# EAGLE schematic ionode (EAGLE 7.7.0)
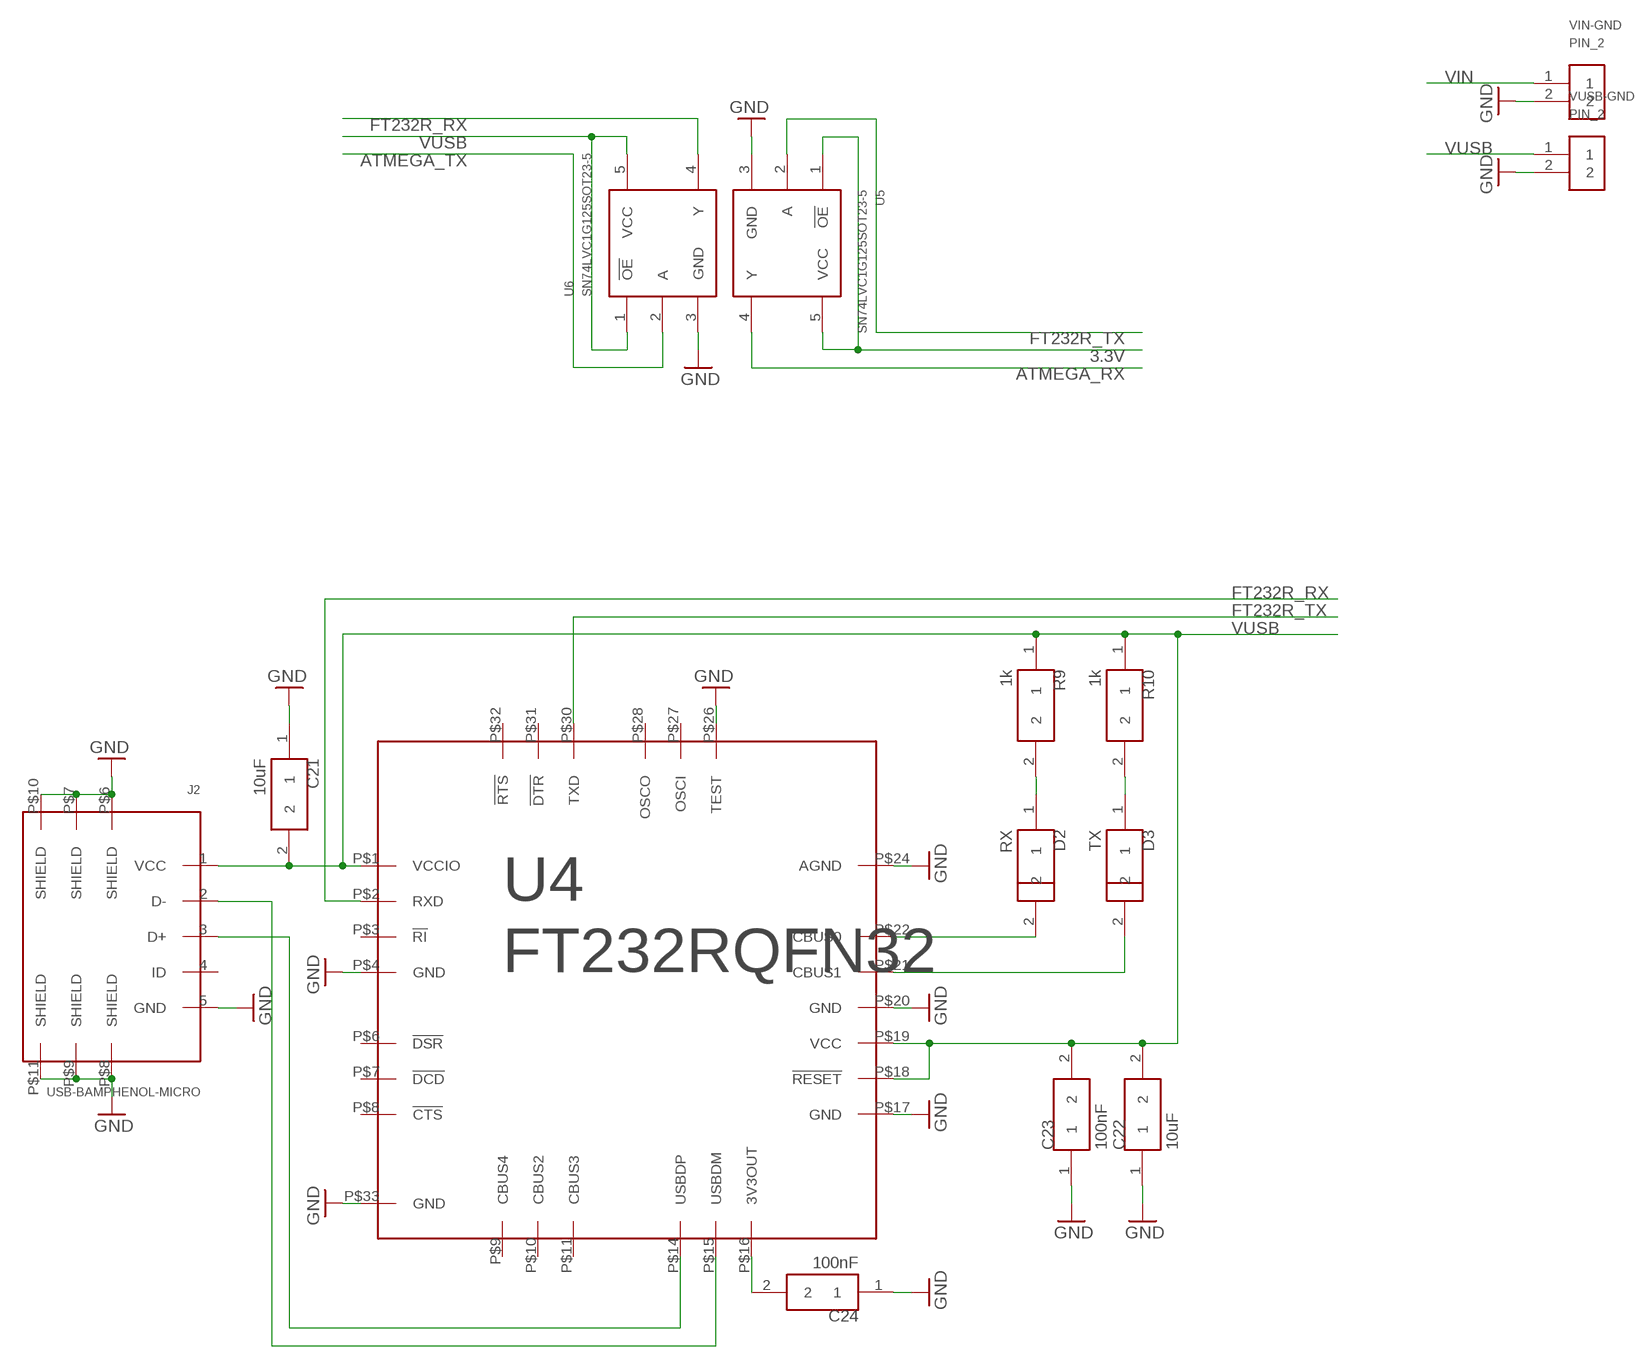
[diagram p0: schematic, sheet 1, part 1 of 2]
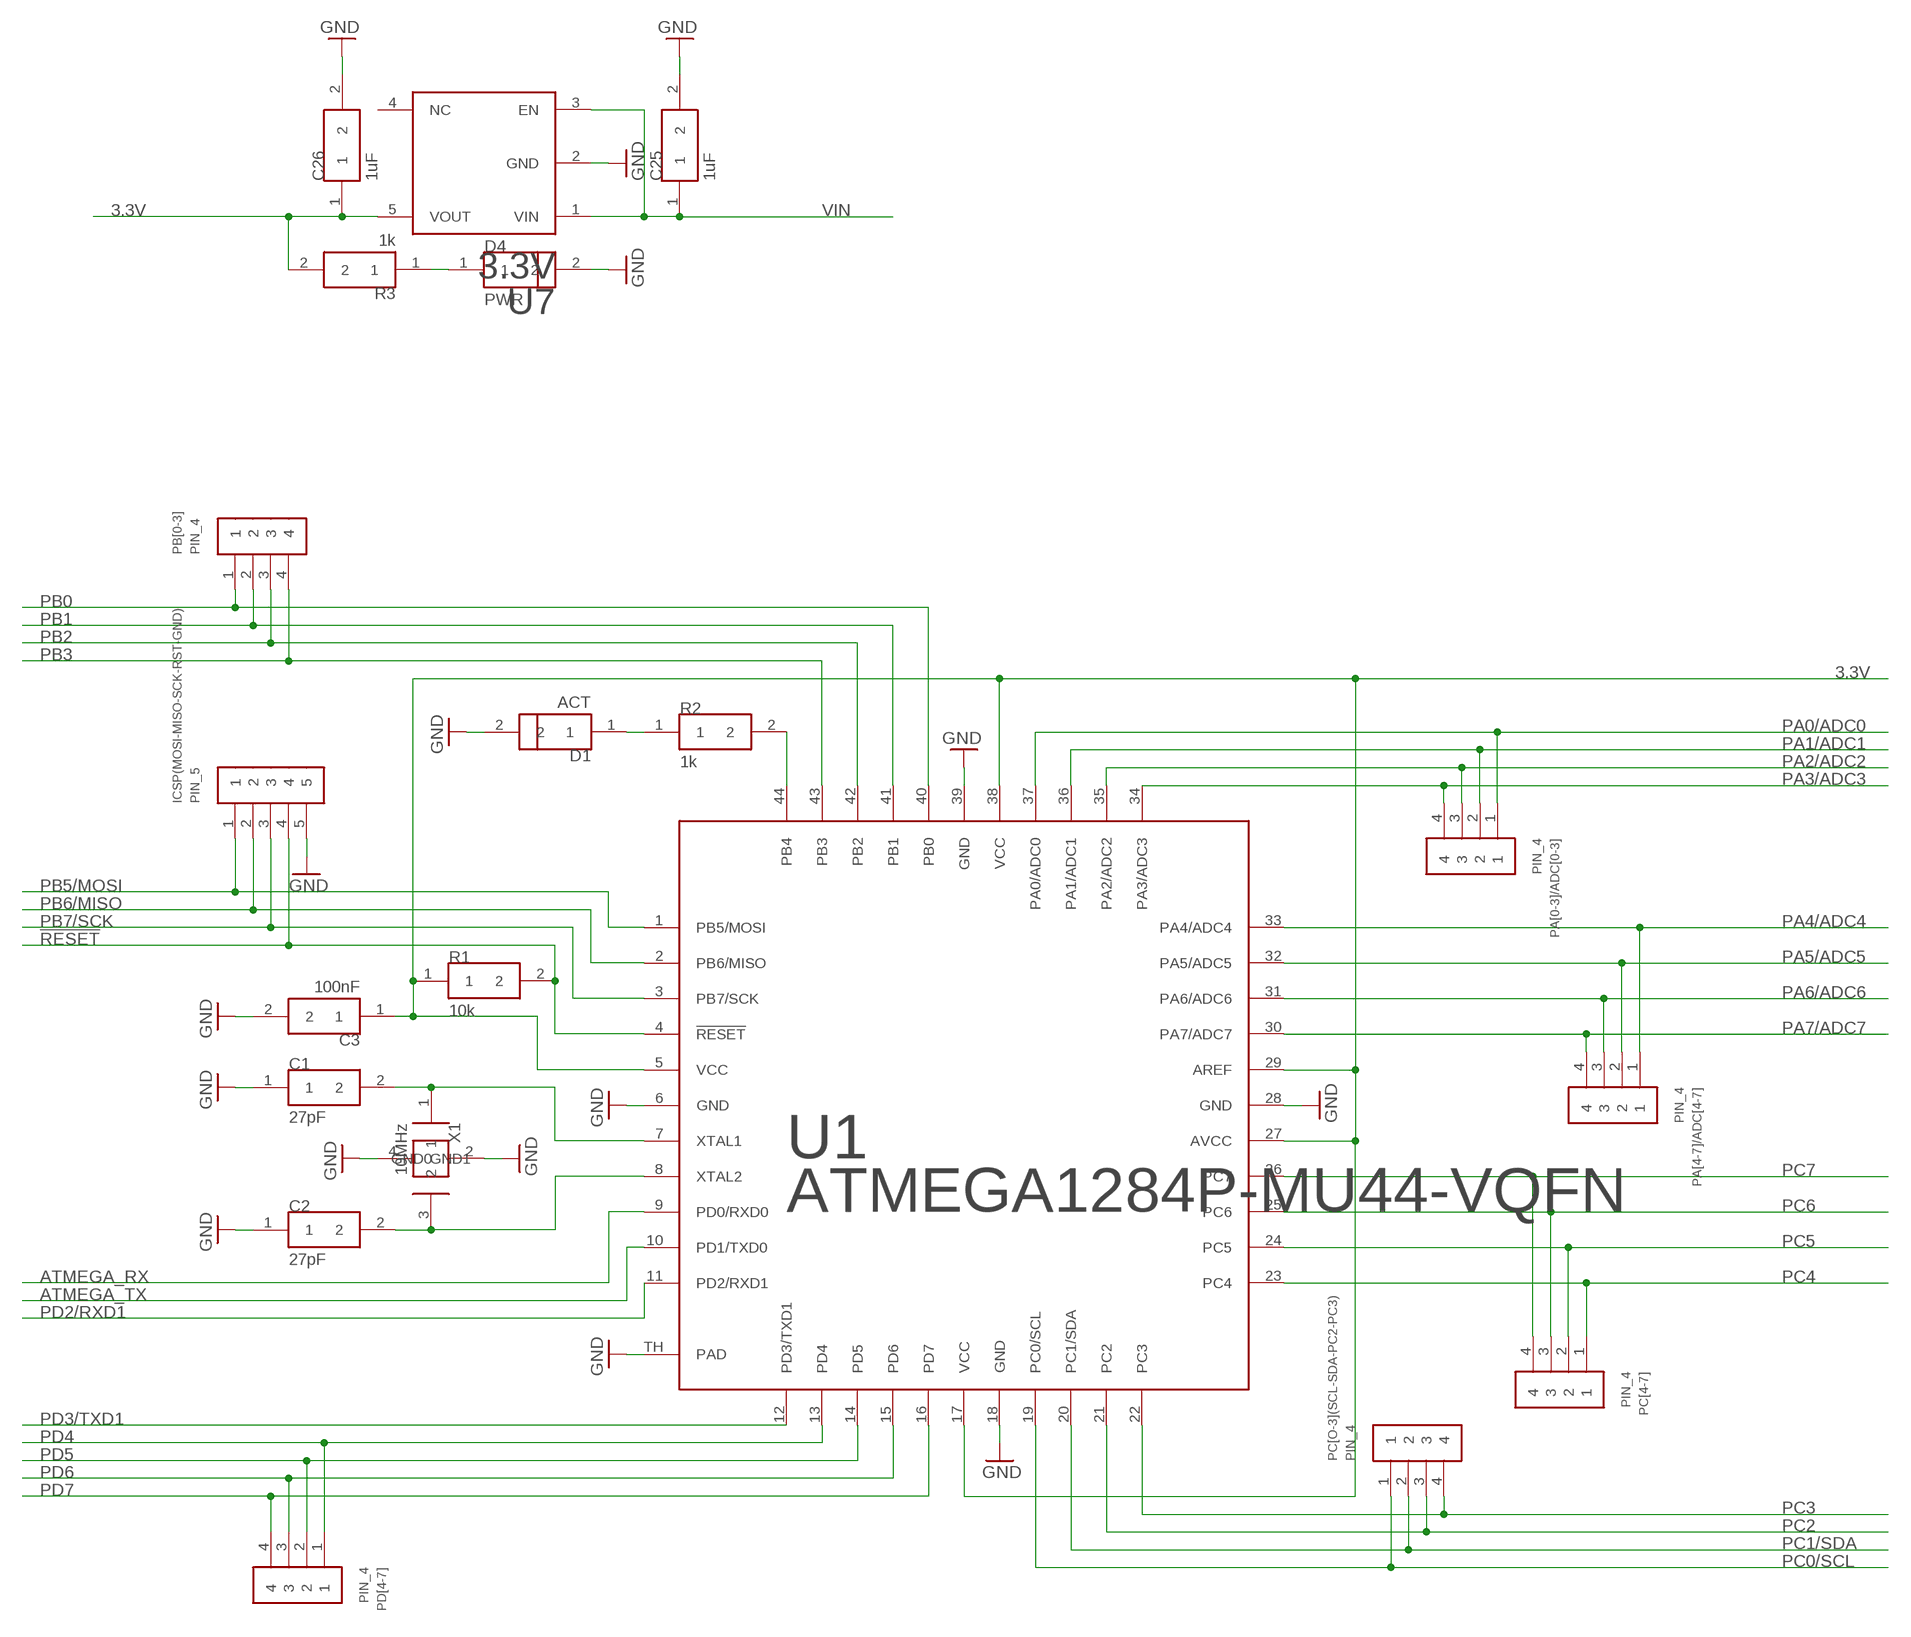
[diagram p1: schematic, sheet 1, part 2 of 2]

## Parts
C1  27pF  CAP0805  [0805]
C2  27pF  CAP0805  [0805]
C3  100nF  CAP0805  [0805]
C21  10uF  CAP0805  [0805]
C22  10uF  CAP0805  [0805]
C23  100nF  CAP0805  [0805]
C24  100nF  CAP0805  [0805]
C25  1uF  CAP0805  [0805]
C26  1uF  CAP0805  [0805]
D1  ACT  LED0805  [0805]
D2  RX  LED0805  [0805]
D3  TX  LED0805  [0805]
D4  PWR  LED0805  [0805]
ICSP(MOSI-MISO-SCK-RST-GND)  PIN_5  [PIN_5]
J2  USB-BAMPHENOL-MICRO  [AMPHENOL-USB-MICRO-B]
PA[0-3]/ADC[0-3]  PIN_4  [PIN_4]
PA[4-7]/ADC[4-7]  PIN_4  [PIN_4]
PB[0-3]  PIN_4  [PIN_4]
PC[4-7]  PIN_4  [PIN_4]
PC[O-3](SCL-SDA-PC2-PC3)  PIN_4  [PIN_4]
PD[4-7]  PIN_4  [PIN_4]
R1  10k  RES0805  [0805]
R2  1k  RES0805  [0805]
R3  1k  RES0805  [0805]
R9  1k  RES0805  [0805]
R10  1k  RES0805  [0805]
U1  ATMEGA1284P-MU44-VQFN  [44-VQFN]
U4  FT232RQFN32  [32-VQFN]
U5  SN74LVC1G125SOT23-5  [SOT23-5]
U6  SN74LVC1G125SOT23-5  [SOT23-5]
U7  3.3V  LP3985SOT23-5  [SOT23-5]
VIN-GND  PIN_2  [PIN_2]
VUSB-GND  PIN_2  [PIN_2]
X1  10MHz  XTAL_GNDSMD_3225  [XTAL_3225]

## Nets
3.3V: C3.1 C26.1 R1.1 R3.2 U1.5(VCC) U1.17(VCC) U1.27(AVCC) U1.29(AREF) U1.38(VCC) U5.1(!OE) U5.5(VCC) U7.5(VOUT)
!RESET: ICSP(MOSI-MISO-SCK-RST-GND).4 R1.2 U1.4(!RESET)
ATMEGA_RX: U1.9(PD0/RXD0) U5.4(Y)
ATMEGA_TX: U1.10(PD1/TXD0) U6.2(A)
FT232R_RX: U4.P$2(RXD) U6.4(Y)
FT232R_TX: U4.P$30(TXD) U5.2(A)
GND: C1.1 C2.1 C3.2 C21.1 C22.1 C23.1 C24.1 C25.2 C26.2 D1.2 D4.2 ICSP(MOSI-MISO-SCK-RST-GND).5 J2.5(GND) J2.P$6(SHIELD) J2.P$7(SHIELD) J2.P$8(SHIELD) J2.P$9(SHIELD) J2.P$10(SHIELD) J2.P$11(SHIELD) U1.6(GND) U1.18(GND) U1.28(GND) U1.39(GND) U1.TH(PAD) U4.P$4(GND) U4.P$17(GND) U4.P$20(GND) U4.P$24(AGND) U4.P$26(TEST) U4.P$33(GND) U5.3(GND) U6.3(GND) U7.2(GND) VIN-GND.2 VUSB-GND.2 X1.2(GND0) X1.4(GND1)
N$1: C2.2 U1.8(XTAL2) X1.3
N$2: C1.2 U1.7(XTAL1) X1.1
N$3: D4.1 R3.1
N$5: D1.1 R2.1
N$6: R2.2 U1.44(PB4)
N$21: C24.2 U4.P$16(3V3OUT)
N$22: D2.2 U4.P$22(CBUS0)
N$23: D3.2 U4.P$21(CBUS1)
N$24: D2.1 R9.2
N$25: D3.1 R10.2
N$26: J2.2(D-) U4.P$15(USBDM)
N$27: J2.3(D+) U4.P$14(USBDP)
PA0/ADC0: PA[0-3]/ADC[0-3].1 U1.37(PA0/ADC0)
PA1/ADC1: PA[0-3]/ADC[0-3].2 U1.36(PA1/ADC1)
PA2/ADC2: PA[0-3]/ADC[0-3].3 U1.35(PA2/ADC2)
PA3/ADC3: PA[0-3]/ADC[0-3].4 U1.34(PA3/ADC3)
PA4/ADC4: PA[4-7]/ADC[4-7].1 U1.33(PA4/ADC4)
PA5/ADC5: PA[4-7]/ADC[4-7].2 U1.32(PA5/ADC5)
PA6/ADC6: PA[4-7]/ADC[4-7].3 U1.31(PA6/ADC6)
PA7/ADC7: PA[4-7]/ADC[4-7].4 U1.30(PA7/ADC7)
PB0: PB[0-3].1 U1.40(PB0)
PB1: PB[0-3].2 U1.41(PB1)
PB2: PB[0-3].3 U1.42(PB2)
PB3: PB[0-3].4 U1.43(PB3)
PB5/MOSI: ICSP(MOSI-MISO-SCK-RST-GND).1 U1.1(PB5/MOSI)
PB6/MISO: ICSP(MOSI-MISO-SCK-RST-GND).2 U1.2(PB6/MISO)
PB7/SCK: ICSP(MOSI-MISO-SCK-RST-GND).3 U1.3(PB7/SCK)
PC0/SCL: PC[O-3](SCL-SDA-PC2-PC3).1 U1.19(PC0/SCL)
PC1/SDA: PC[O-3](SCL-SDA-PC2-PC3).2 U1.20(PC1/SDA)
PC2: PC[O-3](SCL-SDA-PC2-PC3).3 U1.21(PC2)
PC3: PC[O-3](SCL-SDA-PC2-PC3).4 U1.22(PC3)
PC4: PC[4-7].1 U1.23(PC4)
PC5: PC[4-7].2 U1.24(PC5)
PC6: PC[4-7].3 U1.25(PC6)
PC7: PC[4-7].4 U1.26(PC7)
PD2/RXD1: U1.11(PD2/RXD1)
PD3/TXD1: U1.12(PD3/TXD1)
PD4: PD[4-7].1 U1.13(PD4)
PD5: PD[4-7].2 U1.14(PD5)
PD6: PD[4-7].3 U1.15(PD6)
PD7: PD[4-7].4 U1.16(PD7)
VIN: C25.1 U7.1(VIN) U7.3(EN) VIN-GND.1
VUSB: C21.2 C22.2 C23.2 J2.1(VCC) R9.1 R10.1 U4.P$1(VCCIO) U4.P$18(!RESET) U4.P$19(VCC) U6.1(!OE) U6.5(VCC) VUSB-GND.1
Unconnected: J2.4(ID) U4.P$3(!RI) U4.P$6(!DSR) U4.P$7(!DCD) U4.P$8(!CTS) U4.P$9(CBUS4) U4.P$10(CBUS2) U4.P$11(CBUS3) U4.P$27(OSCI) U4.P$28(OSCO) U4.P$31(!DTR) U4.P$32(!RTS) U7.4(NC)

## Library data of the parts
C1-C3 C21-C26 = dooba:CAP
D1-D4 = dooba:LED
ICSP(MOSI-MISO-SCK-RST-GND) = dooba:PIN_5
J2 = dooba:USB-B
PA[0-3]/ADC[0-3] PA[4-7]/ADC[4-7] PB[0-3] PC[4-7] PC[O-3](SCL-SDA-PC2-PC3) PD[4-7] = dooba:PIN_4
R1-R3 R9 R10 = dooba:RES
U1 = dooba:ATMEGA1284P-MU
U4 = dooba:FT232R
U5 U6 = dooba:SN74LVC1G125
U7 = dooba:LP3985
VIN-GND VUSB-GND = dooba:PIN_2
X1 = dooba:XTAL_GND